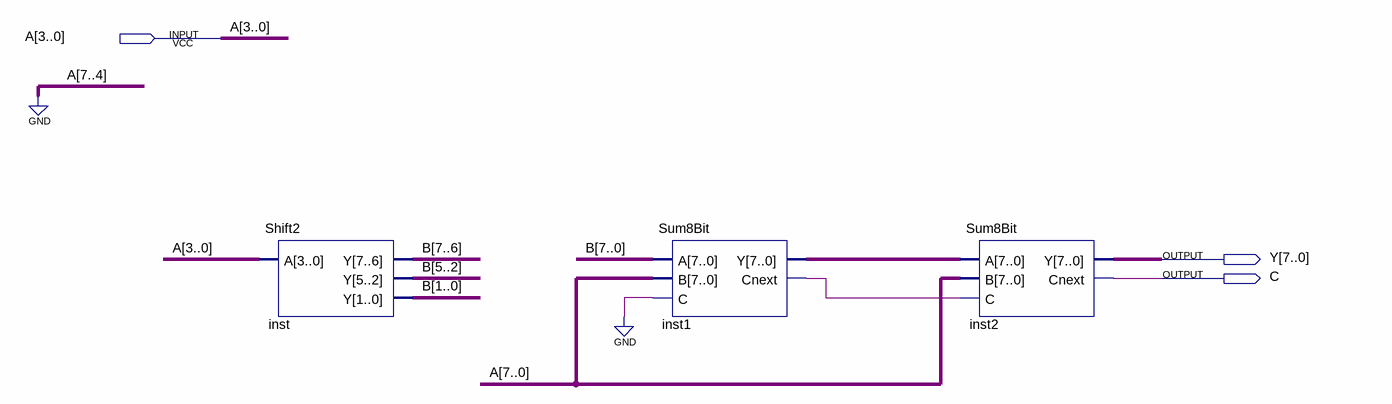
[diagram p0: schematic sheet]
// Quartus schematic MachNhan.bdf as structural Verilog: 3 symbols, 3 pins
module MachNhan (
  input  [3:0] A,
  output [7:0] Y,
  output C
);

  wire inst1_cnext;
  wire [7:0] B, inst1_y;

  Shift2 inst (.A(A), .Y(B));
  Sum8Bit inst1 (.A(B), .B({4'b0000, A}), .C(1'b0), .Y(inst1_y), .Cnext(inst1_cnext));
  Sum8Bit inst2 (.A(inst1_y), .B({4'b0000, A}), .C(inst1_cnext), .Y(Y), .Cnext(C));
endmodule
